# Altium schematic sheet Master_Sheet.SchDoc
size A; SheetNumber: 1; SheetTotal: 4
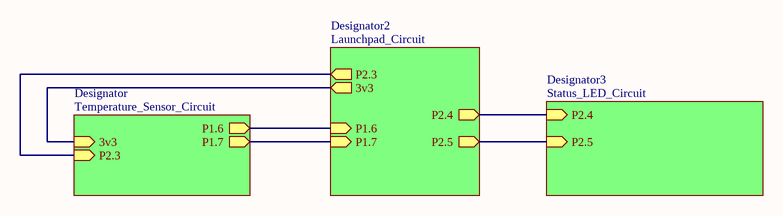
[diagram p0: Master_Sheet.SchDoc]

## Sub-sheets
Designator = Temperature_Sensor_Circuit: P1.6 (out), P1.7 (out), 3v3 (in), P2.3 (in)
Designator2 = Launchpad_Circuit: P2.3 (out), 3v3 (out), P1.6 (in), P1.7 (in), P2.4 (out), P2.5 (out)
Designator3 = Status_LED_Circuit: P2.5 (in), P2.4 (in)

## Nets
(unnamed): sheet Designator/P1.6, sheet Designator2/P1.6
(unnamed): sheet Designator/P1.7, sheet Designator2/P1.7
(unnamed): sheet Designator/3v3, sheet Designator2/3v3
(unnamed): sheet Designator/P2.3, sheet Designator2/P2.3
(unnamed): sheet Designator2/P2.4, sheet Designator3/P2.4
(unnamed): sheet Designator2/P2.5, sheet Designator3/P2.5